# EAGLE design binaryspaceflower (EAGLE 6.5.0)
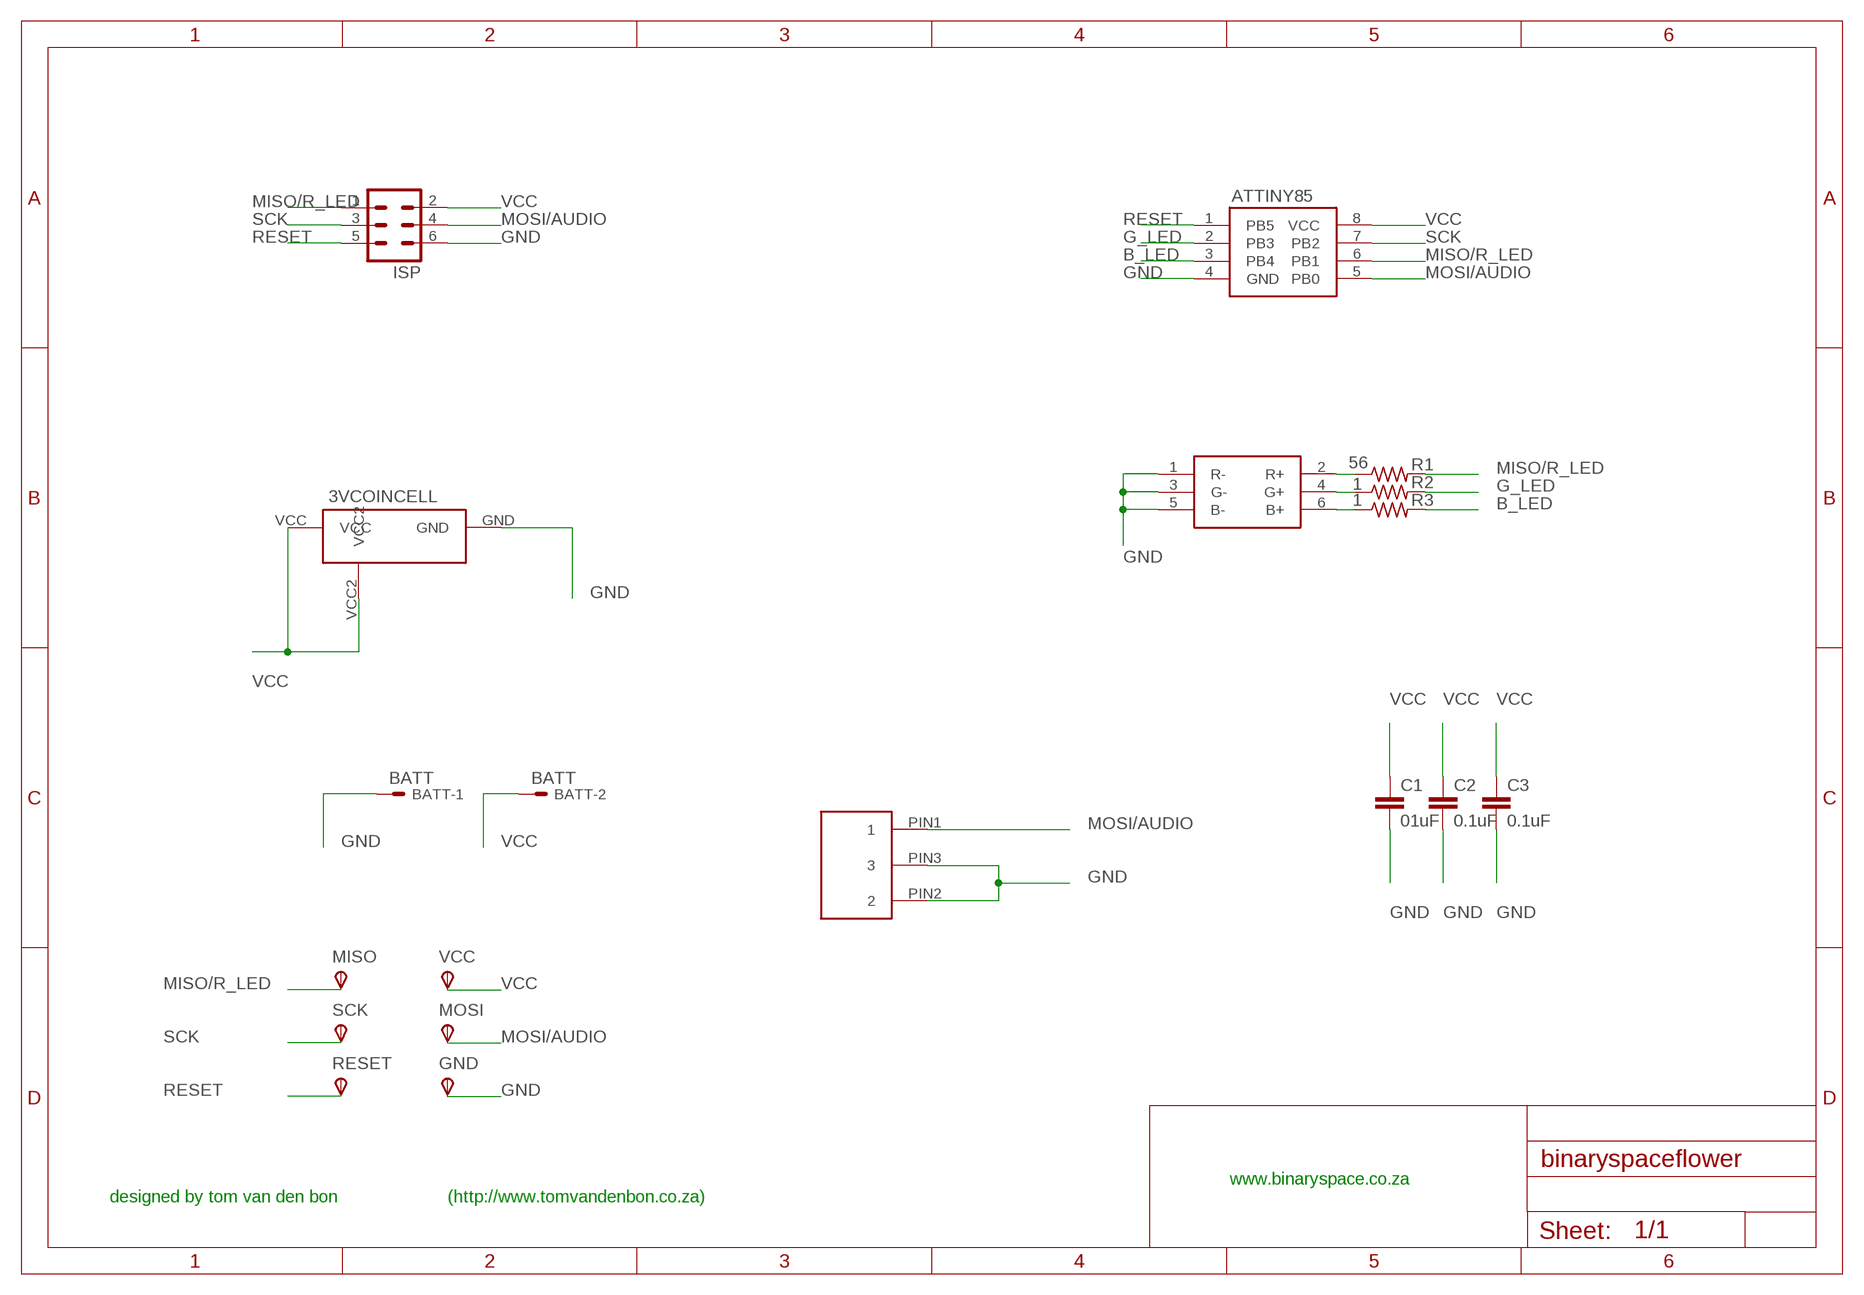
[diagram p0: schematic, sheet 1]

## Parts
3VCOINCELL  SMD_COINCELL_HOLDERRS  [SMD_COINCELLHOLDER]
ATTINY85  ATTINY85ATTINY85  [SOIC-20]
BATT  BATT  332-02  [332-02]
C1  01uF  C-EUC0603  [C0603]
C2  0.1uF  C-EUC0603  [C0603]
C3  0.1uF  C-EUC0603  [C0603]
GND  TPSTP09R  [TP09R]
ISP  MA03-2  [MA03-2]
MISO  TPSTP09R  [TP09R]
MOSI  TPSTP09R  [TP09R]
R1  56  R-US_R0603  [R0603]
R2  1  R-US_R0603  [R0603]
R3  1  R-US_R0603  [R0603]
RESET  TPSTP09R  [TP09R]
SCK  TPSTP09R  [TP09R]
U$2  RGB_SMD_LEDRS  [SMD_RGB_769-2996]
U$3  2.5MMAUDIOJACKMANTECH  [K3624]
VCC  TPSTP09R  [TP09R]

## Nets
B_LED: ATTINY85.3(PB4) R3.2
G_LED: ATTINY85.2(PB3) R2.2
GND: 3VCOINCELL.GND ATTINY85.4(GND) BATT.1 C1.2 C2.2 C3.2 GND.TP(PP) ISP.6 U$2.1(R-) U$2.3(G-) U$2.5(B-) U$3.PIN2 U$3.PIN3
MISO/R_LED: ATTINY85.6(PB1) ISP.1 MISO.TP(PP) R1.2
MOSI/AUDIO: ATTINY85.5(PB0) ISP.4 MOSI.TP(PP) U$3.PIN1
N$1: R1.1 U$2.2(R+)
N$2: R2.1 U$2.4(G+)
N$3: R3.1 U$2.6(B+)
RESET: ATTINY85.1(PB5) ISP.5 RESET.TP(PP)
SCK: ATTINY85.7(PB2) ISP.3 SCK.TP(PP)
VCC: 3VCOINCELL.VCC 3VCOINCELL.VCC2 ATTINY85.8(VCC) BATT.2 C1.1 C2.1 C3.1 ISP.2 VCC.TP(PP)

## Notes on the sheet
- www.binaryspace.co.za
- designed by tom van den bon | (http://www.tomvandenbon.co.za)

## Library data of the parts
3VCOINCELL = protofactory:SMD_COINCELL_HOLDER
ATTINY85 = protofactory:ATTINY85
BATT = con-garry:332-02: 2 Pin - 2mm Dual Row Source: www.mpe-connector.de / garry_shortform_2012.pdf
C1-C3 = rcl:C-EU: CAPACITOR, European symbol
GND MISO MOSI RESET SCK VCC = testpad:TPS: TEST PIN
ISP = con-lstb:MA03-2: PIN HEADER; OC_FARNELL: unknown; OC_NEWARK: unknown
R1-R3 = resistor:R-US_: RESISTOR, American symbol
U$2 = protofactory:RGB_SMD_LED
U$3 = protofactory:2.5MMAUDIOJACK

## Board
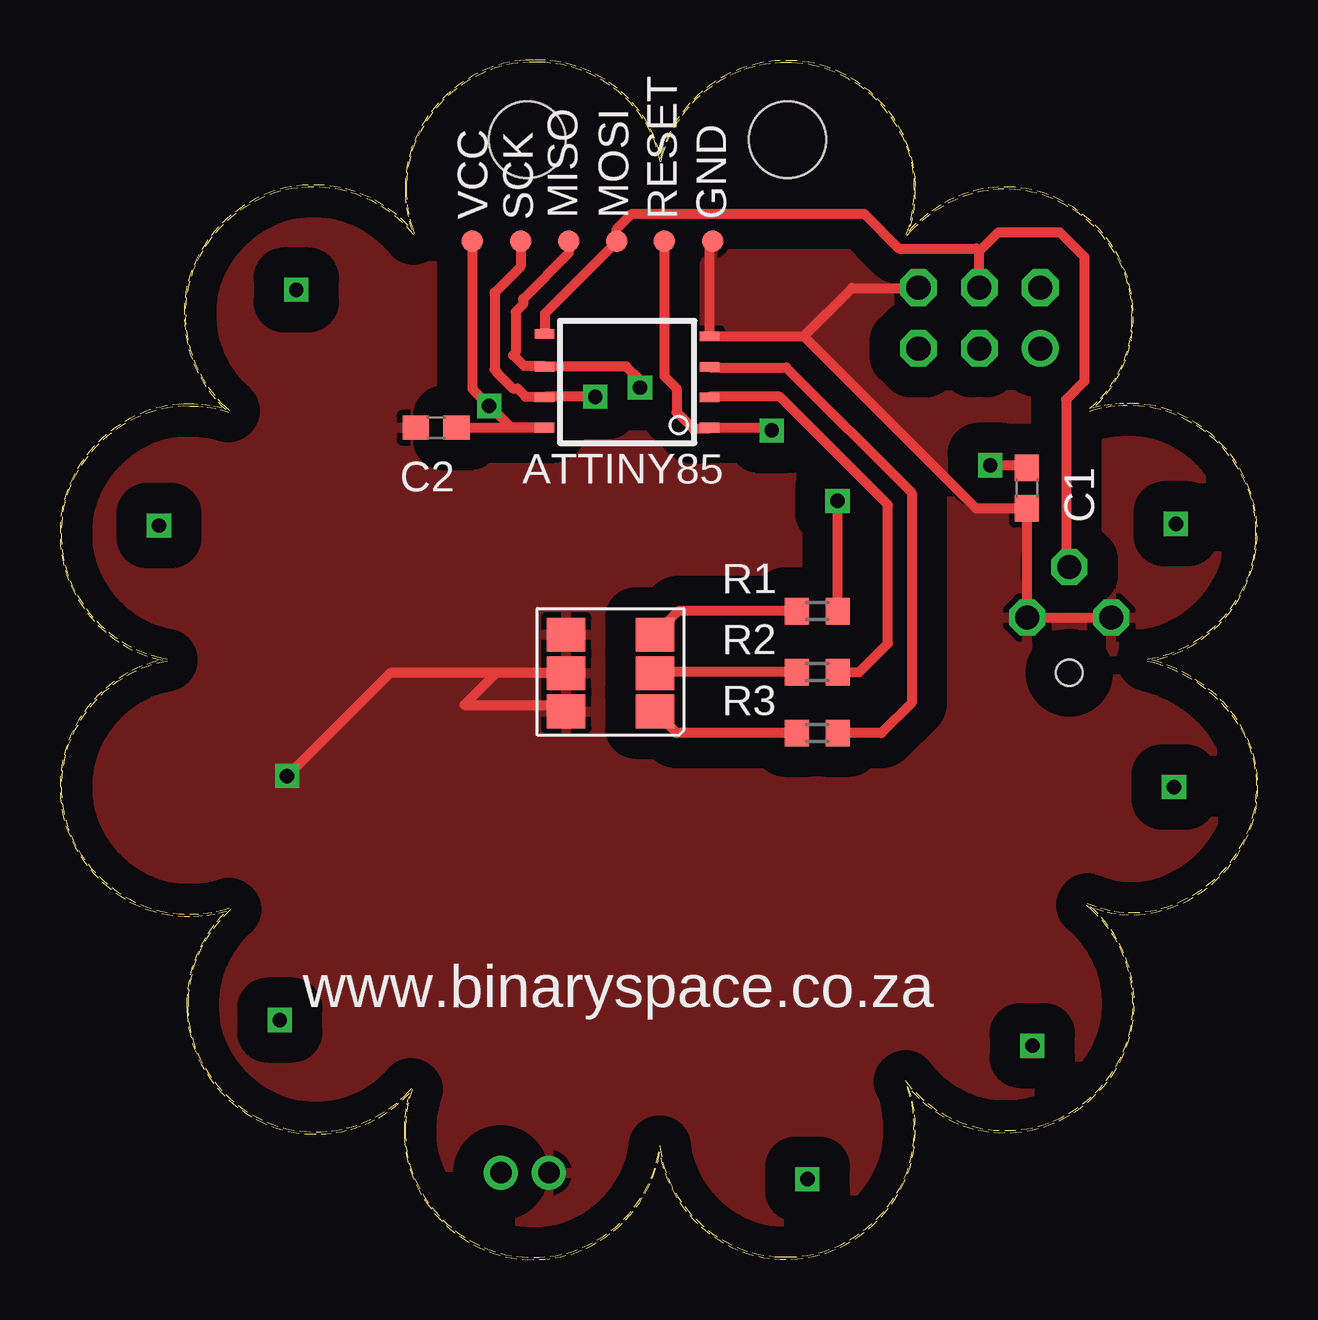
[diagram p1: board, top side]
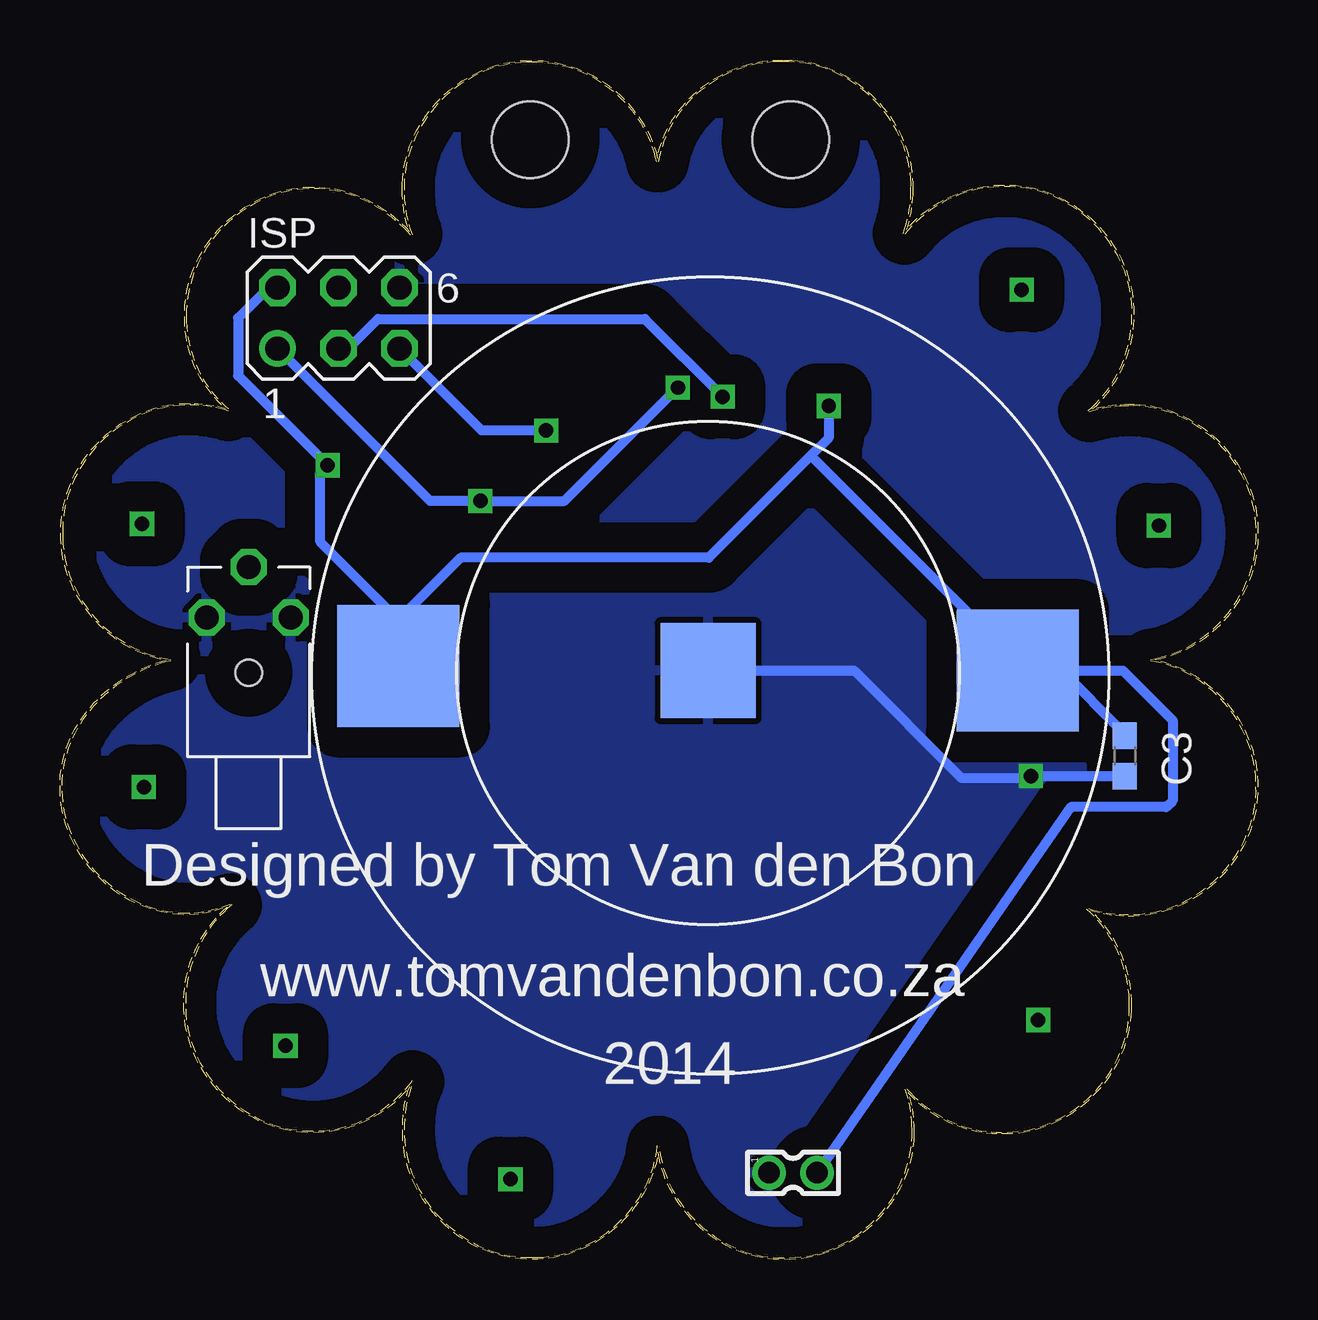
[diagram p2: board, bottom side, seen from below]

Size 49.91 x 50 mm. Coordinates in mm from the lower left corner, seen from the top.
Outline: 18.95,49.94 19.18,49.98 19.41,49.99 19.64,49.99 19.69,50 19.73,50
Outline: 18.72,49.91 18.49,49.86 18.27,49.79
Outline: 18.05,49.73 17.83,49.64 17.62,49.55
Outline: 17.41,49.45 17.2,49.35 17.01,49.22
Outline: 16.81,49.1 16.62,48.97 16.44,48.83
Outline: 16.26,48.68 16.08,48.53 15.92,48.36
Outline: 15.76,48.19 15.61,48.02 15.47,47.83
Outline: 15.33,47.65 15.2,47.46 15.08,47.25
Outline: 14.97,47.05 14.86,46.85 14.77,46.63
Outline: 14.68,46.42 14.61,46.2 14.55,45.97
Outline: 14.49,45.75 14.45,45.52 14.42,45.29
Outline: 14.39,45.07 14.38,44.83 14.38,44.6 14.38,44.41 14.4,44.22 14.42,44.03
Outline: 14.46,44.6 14.45,44.84 14.46,45.07 14.49,45.3
Outline: 14.52,45.53 14.57,45.76 14.63,45.98
Outline: 14.69,46.21 14.76,46.43 14.85,46.64
Outline: 14.95,46.85 15.05,47.06 15.17,47.26
Outline: 15.29,47.46 15.42,47.65 15.56,47.83
Outline: 15.7,48.02 15.86,48.19 16.02,48.36
Outline: 16.18,48.52 16.36,48.68 16.54,48.82
Outline: 16.73,48.96 16.92,49.09 17.12,49.21
Outline: 17.32,49.33 17.53,49.43 17.74,49.52
Outline: 17.95,49.62 18.17,49.69 18.4,49.75
Outline: 18.62,49.81 18.85,49.86 19.08,49.89
Outline: 19.31,49.92 19.54,49.93 19.78,49.92
Outline: 19.78,49.92 20,49.93 20.22,49.92 20.44,49.89
Outline: 20.66,49.87 20.87,49.83 21.08,49.78
Outline: 21.3,49.73 21.51,49.66 21.71,49.59
Outline: 21.92,49.51 22.12,49.42 22.31,49.32
Outline: 22.51,49.22 22.7,49.1 22.88,48.98
Outline: 23.06,48.85 23.23,48.71 23.39,48.57
Outline: 23.56,48.42 23.71,48.27 23.86,48.1
Outline: 24,47.94 24.14,47.76 24.26,47.58
Outline: 24.38,47.39 24.49,47.2 24.58,47.01
Outline: 24.68,46.81 24.76,46.61 24.83,46.4
Outline: 24.89,46.19 24.94,45.97 24.98,45.75
Outline: 25.06,45.75 25.1,45.97 25.16,46.18 25.23,46.38
Outline: 25.31,46.59 25.39,46.79 25.49,46.98
Outline: 25.59,47.17 25.7,47.36 25.82,47.54
Outline: 25.95,47.72 26.08,47.89 26.22,48.06
Outline: 26.37,48.22 26.52,48.38 26.68,48.52
Outline: 26.84,48.67 27.01,48.8 27.19,48.93
Outline: 27.37,49.05 27.55,49.17 27.74,49.27
Outline: 27.94,49.38 28.13,49.47 28.34,49.55
Outline: 28.54,49.63 28.74,49.7 28.96,49.75
Outline: 29.17,49.8 29.38,49.84 29.6,49.87
Outline: 29.81,49.89 30.03,49.9 30.25,49.9
Outline: 30.25,49.9 30.49,49.91 30.72,49.89 30.95,49.86
Outline: 31.18,49.84 31.41,49.79 31.63,49.73
Outline: 31.86,49.67 32.08,49.59 32.29,49.5
Outline: 32.5,49.41 32.71,49.3 32.91,49.19
Outline: 33.11,49.07 33.3,48.94 33.48,48.8
Outline: 33.67,48.65 33.84,48.5 34.01,48.34
Outline: 34.17,48.17 34.33,48 34.47,47.81
Outline: 34.61,47.63 34.74,47.44 34.86,47.24
Outline: 34.98,47.04 35.08,46.83 35.17,46.62
Outline: 35.27,46.4 35.34,46.18 35.4,45.96
Outline: 35.46,45.74 35.51,45.51 35.54,45.28
Outline: 35.57,45.05 35.58,44.81 35.57,44.58
Outline: 35.57,44.37 35.56,44.16 35.54,43.95
Outline: 35.51,43.74 35.48,43.53 35.43,43.33
Outline: 35.38,43.13 35.32,42.92 35.24,42.73
Outline: 35.3,42.69 35.44,42.86 35.6,43.01 35.76,43.16
Outline: 35.92,43.31 36.09,43.45 36.27,43.58
Outline: 36.44,43.71 36.63,43.83 36.82,43.94
Outline: 37.01,44.05 37.2,44.14 37.4,44.23
Outline: 37.61,44.31 37.81,44.39 38.02,44.45
Outline: 38.24,44.51 38.45,44.55 38.67,44.58
Outline: 38.88,44.61 39.1,44.63 39.32,44.63
Outline: 39.56,44.63 39.79,44.62 40.02,44.59
Outline: 40.25,44.56 40.48,44.52 40.7,44.46
Outline: 40.92,44.4 41.14,44.32 41.36,44.23
Outline: 41.57,44.14 41.78,44.03 41.98,43.91
Outline: 42.18,43.8 42.37,43.67 42.55,43.53
Outline: 42.74,43.38 42.91,43.23 43.08,43.06
Outline: 43.24,42.9 43.4,42.72 43.54,42.54
Outline: 43.68,42.36 43.81,42.16 43.93,41.96
Outline: 44.05,41.76 44.15,41.56 44.24,41.34
Outline: 44.33,41.13 44.41,40.91 44.47,40.69
Outline: 44.53,40.46 44.58,40.24 44.61,40
Outline: 44.63,39.77 44.65,39.54 44.64,39.31
Outline: 44.64,39.31 44.65,39.1 44.64,38.89 44.61,38.68
Outline: 44.59,38.48 44.55,38.27 44.5,38.07
Outline: 44.45,37.87 44.39,37.67 44.32,37.48
Outline: 44.24,37.28 44.16,37.09 44.06,36.91
Outline: 43.96,36.72 43.85,36.55 43.73,36.38
Outline: 43.61,36.21 43.48,36.04 43.34,35.89
Outline: 43.2,35.74 43.05,35.6 42.89,35.46
Outline: 42.9,35.37 43.07,35.43 43.24,35.47 43.42,35.51
Outline: 43.59,35.54 43.77,35.57 43.95,35.58
Outline: 44.12,35.6 44.3,35.61 44.48,35.61
Outline: 44.71,35.61 44.95,35.6 45.18,35.57
Outline: 45.41,35.54 45.63,35.5 45.86,35.44
Outline: 46.08,35.38 46.3,35.3 46.52,35.21
Outline: 46.73,35.12 46.94,35.01 47.14,34.89
Outline: 47.34,34.78 47.53,34.65 47.71,34.51
Outline: 47.89,34.36 48.07,34.21 48.24,34.04
Outline: 48.4,33.88 48.55,33.7 48.7,33.52
Outline: 48.84,33.34 48.97,33.15 49.09,32.94
Outline: 49.2,32.74 49.31,32.54 49.4,32.32
Outline: 49.49,32.11 49.57,31.89 49.63,31.67
Outline: 49.69,31.44 49.74,31.22 49.76,30.98
Outline: 49.79,30.76 49.81,30.52 49.8,30.29
Outline: 49.8,30.29 49.8,30.06 49.79,29.83 49.76,29.6
Outline: 49.74,29.38 49.69,29.15 49.63,28.93
Outline: 49.57,28.71 49.5,28.49 49.41,28.28
Outline: 49.33,28.07 49.22,27.86 49.11,27.67
Outline: 49,27.47 48.87,27.28 48.73,27.1
Outline: 48.6,26.91 48.45,26.74 48.29,26.57
Outline: 48.13,26.41 47.96,26.26 47.78,26.11
Outline: 47.61,25.97 47.42,25.84 47.22,25.72
Outline: 47.03,25.6 46.83,25.49 46.62,25.4
Outline: 46.41,25.31 46.19,25.23 45.97,25.16
Outline: 45.76,25.1 45.53,25.05 45.3,25.02
Outline: 45.3,24.95 45.52,24.9 45.74,24.84 45.95,24.77
Outline: 46.16,24.69 46.37,24.61 46.57,24.51
Outline: 46.78,24.42 46.97,24.31 47.17,24.19
Outline: 47.36,24.07 47.54,23.94 47.72,23.8
Outline: 47.9,23.67 48.07,23.52 48.23,23.36
Outline: 48.39,23.21 48.54,23.04 48.68,22.87
Outline: 48.83,22.69 48.96,22.51 49.08,22.32
Outline: 49.2,22.13 49.3,21.93 49.4,21.73
Outline: 49.49,21.53 49.57,21.31 49.64,21.1
Outline: 49.7,20.88 49.75,20.67 49.79,20.44
Outline: 49.82,20.22 49.84,20 49.84,19.77
Outline: 49.84,19.54 49.83,19.3 49.8,19.07
Outline: 49.77,18.84 49.73,18.61 49.67,18.39
Outline: 49.6,18.17 49.53,17.95 49.44,17.73
Outline: 49.35,17.52 49.24,17.31 49.12,17.11
Outline: 49,16.91 48.87,16.72 48.73,16.54
Outline: 48.59,16.35 48.44,16.18 48.27,16.01
Outline: 48.11,15.85 47.93,15.7 47.75,15.55
Outline: 47.57,15.41 47.37,15.28 47.17,15.16
Outline: 46.97,15.04 46.77,14.94 46.55,14.85
Outline: 46.34,14.76 46.12,14.68 45.89,14.62
Outline: 45.67,14.56 45.44,14.51 45.21,14.48
Outline: 44.98,14.45 44.75,14.44 44.51,14.45
Outline: 44.32,14.45 44.12,14.47 43.93,14.5
Outline: 43.74,14.54 43.55,14.58 43.36,14.64
Outline: 43.17,14.7 42.99,14.76 42.81,14.83
Outline: 42.76,14.77 42.94,14.63 43.1,14.48 43.25,14.31
Outline: 43.4,14.15 43.54,13.98 43.67,13.8
Outline: 43.8,13.62 43.92,13.43 44.02,13.24
Outline: 44.13,13.04 44.22,12.84 44.31,12.64
Outline: 44.39,12.43 44.46,12.22 44.51,12
Outline: 44.57,11.79 44.61,11.57 44.64,11.35
Outline: 44.67,11.13 44.68,10.91 44.68,10.69
Outline: 44.68,10.45 44.67,10.22 44.64,9.99
Outline: 44.61,9.76 44.57,9.53 44.51,9.31
Outline: 44.45,9.08 44.37,8.86 44.28,8.65
Outline: 44.19,8.43 44.08,8.23 43.96,8.03
Outline: 43.85,7.83 43.72,7.64 43.57,7.45
Outline: 43.43,7.27 43.28,7.09 43.11,6.93
Outline: 42.95,6.76 42.77,6.61 42.59,6.47
Outline: 42.41,6.33 42.21,6.2 42.01,6.08
Outline: 41.81,5.96 41.61,5.85 41.39,5.76
Outline: 41.18,5.67 40.96,5.6 40.74,5.53
Outline: 40.51,5.47 40.28,5.43 40.05,5.4
Outline: 39.82,5.37 39.59,5.36 39.36,5.36
Outline: 39.13,5.36 38.9,5.37 38.67,5.4
Outline: 38.45,5.44 38.22,5.48 38,5.55
Outline: 37.78,5.61 37.57,5.68 37.36,5.78
Outline: 37.15,5.87 36.95,5.97 36.75,6.09
Outline: 36.56,6.21 36.37,6.34 36.19,6.48
Outline: 36.01,6.62 35.84,6.77 35.68,6.94
Outline: 35.52,7.1 35.37,7.27 35.23,7.46
Outline: 35.23,7.46 35.23,7.46 35.23,7.46
Outline: 35.17,7.43 35.17,7.42 35.17,7.42 35.17,7.42
Outline: 35.27,7.21 35.35,7 35.41,6.77
Outline: 35.47,6.55 35.51,6.33 35.53,6.1
Outline: 35.55,5.87 35.56,5.64 35.56,5.41
Outline: 35.56,5.18 35.55,4.95 35.52,4.72
Outline: 35.5,4.49 35.45,4.26 35.39,4.03
Outline: 35.33,3.81 35.25,3.59 35.16,3.38
Outline: 35.07,3.16 34.96,2.96 34.85,2.76
Outline: 34.73,2.56 34.6,2.36 34.46,2.18
Outline: 34.31,2 34.16,1.82 34,1.66
Outline: 33.83,1.49 33.65,1.34 33.47,1.2
Outline: 33.29,1.05 33.1,0.92 32.9,0.81
Outline: 32.7,0.69 32.49,0.58 32.28,0.49
Outline: 32.06,0.4 31.84,0.32 31.62,0.26
Outline: 31.39,0.2 31.17,0.16 30.93,0.13
Outline: 30.71,0.1 30.47,0.09 30.24,0.09
Outline: 30.24,0.09 30,0.09 29.77,0.1 29.54,0.13
Outline: 29.31,0.16 29.09,0.2 28.86,0.26
Outline: 28.64,0.33 28.42,0.4 28.21,0.5
Outline: 28,0.59 27.79,0.69 27.59,0.81
Outline: 27.4,0.93 27.21,1.06 27.02,1.2
Outline: 26.84,1.35 26.67,1.5 26.51,1.67
Outline: 26.34,1.83 26.19,2.01 26.05,2.19
Outline: 25.91,2.38 25.78,2.57 25.67,2.77
Outline: 25.55,2.97 25.45,3.18 25.36,3.39
Outline: 25.28,3.61 25.2,3.83 25.15,4.05
Outline: 25.09,4.27 25.05,4.5 25.02,4.73
Outline: 24.95,4.72 24.95,4.72 24.95,4.72 24.95,4.72
Outline: 24.92,4.48 24.88,4.26 24.83,4.03
Outline: 24.77,3.81 24.69,3.59 24.61,3.38
Outline: 24.52,3.16 24.42,2.95 24.3,2.75
Outline: 24.19,2.55 24.06,2.36 23.92,2.18
Outline: 23.78,1.99 23.63,1.82 23.46,1.65
Outline: 23.3,1.49 23.13,1.33 22.95,1.19
Outline: 22.77,1.05 22.57,0.91 22.38,0.8
Outline: 22.18,0.68 21.97,0.57 21.76,0.48
Outline: 21.55,0.39 21.33,0.31 21.11,0.25
Outline: 20.88,0.19 20.66,0.14 20.43,0.11
Outline: 20.2,0.08 19.97,0.07 19.73,0.08
Outline: 19.5,0.07 19.27,0.08 19.04,0.11
Outline: 18.81,0.14 18.58,0.19 18.36,0.25
Outline: 18.13,0.31 17.91,0.38 17.7,0.48
Outline: 17.48,0.57 17.28,0.67 17.08,0.79
Outline: 16.88,0.91 16.68,1.04 16.5,1.18
Outline: 16.32,1.32 16.14,1.48 15.98,1.64
Outline: 15.81,1.81 15.66,1.98 15.52,2.16
Outline: 15.37,2.35 15.24,2.54 15.13,2.74
Outline: 15.01,2.94 14.9,3.15 14.81,3.36
Outline: 14.72,3.57 14.64,3.79 14.58,4.02
Outline: 14.52,4.24 14.48,4.47 14.45,4.7
Outline: 14.42,4.93 14.41,5.16 14.41,5.4
Outline: 14.38,4.69 14.35,4.93 14.33,5.16 14.34,5.4 14.34,5.58 14.35,5.75
Outline: 14.4,4.46 14.45,4.23 14.51,4
Outline: 14.57,3.78 14.65,3.55 14.74,3.34
Outline: 14.83,3.12 14.94,2.91 15.06,2.7
Outline: 15.18,2.5 15.31,2.31 15.46,2.12
Outline: 15.6,1.93 15.76,1.76 15.92,1.59
Outline: 16.09,1.42 16.27,1.27 16.45,1.12
Outline: 16.64,0.98 16.84,0.85 17.04,0.73
Outline: 17.24,0.61 17.45,0.5 17.67,0.41
Outline: 17.89,0.32 18.11,0.24 18.34,0.18
Outline: 18.56,0.12 18.79,0.07 19.03,0.04
Outline: 19.26,0.01 19.5,0 19.73,0
Outline: 19.96,0 20.19,0.01 20.41,0.04
Outline: 20.64,0.07 20.86,0.11 21.08,0.17
Outline: 21.3,0.23 21.52,0.3 21.73,0.39
Outline: 21.94,0.47 22.14,0.57 22.34,0.69
Outline: 22.53,0.8 22.72,0.93 22.9,1.06
Outline: 23.08,1.2 23.26,1.35 23.42,1.51
Outline: 23.58,1.67 23.74,1.83 23.88,2.01
Outline: 24.02,2.19 24.15,2.37 24.27,2.57
Outline: 24.39,2.76 24.5,2.96 24.59,3.17
Outline: 24.68,3.37 24.77,3.58 24.83,3.8
Outline: 24.9,4.02 24.95,4.24 24.99,4.46
Outline: 25.02,4.24 25.08,4.02 25.14,3.8
Outline: 25.21,3.59 25.29,3.38 25.39,3.17
Outline: 25.48,2.96 25.59,2.76 25.71,2.57
Outline: 25.82,2.38 25.96,2.19 26.1,2.02
Outline: 26.24,1.84 26.4,1.67 26.56,1.52
Outline: 26.72,1.36 26.89,1.21 27.07,1.08
Outline: 27.25,0.94 27.44,0.81 27.64,0.7
Outline: 27.84,0.59 28.04,0.49 28.25,0.4
Outline: 28.46,0.31 28.67,0.24 28.89,0.18
Outline: 29.11,0.13 29.33,0.08 29.56,0.05
Outline: 29.78,0.03 30.01,0.02 30.24,0.02
Outline: 30.24,0.02 30.24,0.02
Outline: 30.24,0.02 30.24,0.02
Outline: 30.48,0.02 30.71,0.03 30.94,0.06
Outline: 31.18,0.09 31.41,0.13 31.64,0.19
Outline: 31.86,0.25 32.09,0.33 32.3,0.43
Outline: 32.52,0.52 32.73,0.62 32.93,0.74
Outline: 33.13,0.86 33.33,1 33.52,1.14
Outline: 33.7,1.28 33.88,1.44 34.05,1.61
Outline: 34.21,1.77 34.37,1.95 34.51,2.14
Outline: 34.66,2.32 34.79,2.52 34.91,2.72
Outline: 35.03,2.92 35.13,3.13 35.23,3.35
Outline: 35.32,3.57 35.4,3.79 35.46,4.02
Outline: 35.52,4.24 35.57,4.47 35.6,4.71
Outline: 35.62,4.94 35.64,5.18 35.63,5.41
Outline: 35.63,5.41 35.63,5.42
Outline: 35.63,5.42 35.63,5.42
Outline: 35.63,5.62 35.63,5.82 35.61,6.02
Outline: 35.59,6.22 35.56,6.42 35.52,6.62
Outline: 35.47,6.82 35.42,7.02 35.34,7.2
Outline: 35.48,7.04 35.63,6.88 35.79,6.73
Outline: 35.95,6.58 36.12,6.44 36.3,6.31
Outline: 36.47,6.18 36.65,6.06 36.84,5.95
Outline: 37.04,5.84 37.23,5.75 37.44,5.66
Outline: 37.64,5.58 37.84,5.51 38.06,5.46
Outline: 38.27,5.4 38.48,5.36 38.7,5.33
Outline: 38.92,5.3 39.13,5.29 39.35,5.29
Outline: 39.36,5.29 39.36,5.29
Outline: 39.36,5.29 39.36,5.29
Outline: 39.59,5.29 39.83,5.3 40.06,5.33
Outline: 40.3,5.36 40.53,5.4 40.75,5.47
Outline: 40.98,5.53 41.2,5.61 41.42,5.7
Outline: 41.64,5.79 41.85,5.9 42.05,6.02
Outline: 42.25,6.14 42.45,6.27 42.63,6.41
Outline: 42.82,6.56 43,6.71 43.16,6.88
Outline: 43.33,7.04 43.49,7.22 43.63,7.41
Outline: 43.77,7.59 43.91,7.79 44.03,7.99
Outline: 44.15,8.2 44.25,8.4 44.34,8.62
Outline: 44.44,8.84 44.52,9.06 44.58,9.29
Outline: 44.64,9.52 44.68,9.75 44.71,9.98
Outline: 44.74,10.21 44.75,10.45 44.75,10.69
Outline: 44.75,10.69 44.75,10.69
Outline: 44.75,10.69 44.75,10.69
Outline: 44.75,10.9 44.74,11.12 44.71,11.33
Outline: 44.69,11.55 44.65,11.76 44.6,11.97
Outline: 44.54,12.18 44.48,12.39 44.4,12.59
Outline: 44.33,12.79 44.24,12.99 44.14,13.18
Outline: 44.04,13.37 43.93,13.55 43.8,13.73
Outline: 43.68,13.91 43.55,14.08 43.41,14.25
Outline: 43.27,14.41 43.12,14.56 42.95,14.7
Outline: 43.12,14.64 43.29,14.59 43.46,14.54
Outline: 43.63,14.49 43.81,14.45 43.98,14.42
Outline: 44.16,14.39 44.33,14.37 44.51,14.38
Outline: 44.51,14.38 44.51,14.38
Outline: 44.51,14.38 44.51,14.38
Outline: 44.75,14.37 44.99,14.38 45.22,14.41
Outline: 45.45,14.44 45.69,14.49 45.91,14.55
Outline: 46.14,14.61 46.36,14.69 46.58,14.78
Outline: 46.8,14.87 47.01,14.98 47.21,15.1
Outline: 47.41,15.22 47.61,15.35 47.79,15.49
Outline: 47.98,15.64 48.16,15.8 48.32,15.96
Outline: 48.49,16.13 48.65,16.3 48.79,16.49
Outline: 48.93,16.68 49.07,16.87 49.19,17.07
Outline: 49.31,17.28 49.41,17.49 49.5,17.71
Outline: 49.6,17.92 49.67,18.15 49.74,18.37
Outline: 49.8,18.6 49.84,18.83 49.87,19.07
Outline: 49.9,19.3 49.91,19.53 49.91,19.77
Outline: 49.91,20 49.89,20.22 49.86,20.44
Outline: 49.83,20.66 49.78,20.87 49.72,21.09
Outline: 49.65,21.3 49.58,21.51 49.48,21.71
Outline: 49.39,21.91 49.29,22.11 49.17,22.3
Outline: 49.06,22.49 48.93,22.67 48.79,22.85
Outline: 48.65,23.02 48.5,23.19 48.35,23.35
Outline: 48.19,23.5 48.03,23.65 47.85,23.79
Outline: 47.68,23.93 47.5,24.06 47.31,24.18
Outline: 47.12,24.3 46.93,24.41 46.73,24.51
Outline: 46.53,24.61 46.33,24.7 46.12,24.78
Outline: 45.91,24.86 45.7,24.93 45.49,24.98
Outline: 45.71,25.02 45.93,25.07 46.14,25.14
Outline: 46.36,25.21 46.57,25.3 46.77,25.39
Outline: 46.98,25.49 47.18,25.6 47.37,25.73
Outline: 47.56,25.85 47.74,25.98 47.91,26.13
Outline: 48.09,26.27 48.25,26.43 48.41,26.59
Outline: 48.56,26.76 48.7,26.93 48.84,27.12
Outline: 48.97,27.3 49.09,27.49 49.2,27.69
Outline: 49.31,27.88 49.41,28.09 49.5,28.3
Outline: 49.58,28.51 49.65,28.72 49.71,28.94
Outline: 49.77,29.16 49.81,29.38 49.84,29.61
Outline: 49.86,29.83 49.88,30.06 49.87,30.29
Outline: 49.87,30.29 49.87,30.29
Outline: 49.87,30.29 49.87,30.29
Outline: 49.88,30.53 49.86,30.76 49.84,30.99
Outline: 49.81,31.23 49.76,31.46 49.7,31.68
Outline: 49.64,31.91 49.56,32.14 49.47,32.35
Outline: 49.37,32.57 49.27,32.78 49.15,32.98
Outline: 49.03,33.18 48.9,33.38 48.75,33.57
Outline: 48.61,33.75 48.45,33.93 48.29,34.1
Outline: 48.12,34.26 47.94,34.42 47.76,34.56
Outline: 47.57,34.71 47.37,34.84 47.17,34.96
Outline: 46.97,35.08 46.76,35.18 46.54,35.28
Outline: 46.33,35.37 46.1,35.45 45.88,35.51
Outline: 45.65,35.57 45.42,35.62 45.18,35.64
Outline: 44.95,35.67 44.72,35.69 44.48,35.68 44.48,35.68 44.48,35.68
Outline: 44.31,35.68 44.15,35.67 43.99,35.66
Outline: 43.83,35.64 43.67,35.62 43.5,35.6
Outline: 43.34,35.57 43.19,35.53 43.03,35.49
Outline: 43.18,35.62 43.33,35.77 43.46,35.92
Outline: 43.6,36.07 43.72,36.24 43.84,36.41
Outline: 43.95,36.58 44.06,36.75 44.15,36.93
Outline: 44.25,37.12 44.33,37.3 44.4,37.5
Outline: 44.47,37.69 44.53,37.89 44.58,38.09
Outline: 44.63,38.28 44.66,38.49 44.68,38.69
Outline: 44.71,38.9 44.72,39.1 44.71,39.31 44.71,39.31 44.71,39.31
Outline: 44.72,39.55 44.71,39.78 44.68,40.01
Outline: 44.65,40.25 44.6,40.48 44.54,40.7
Outline: 44.48,40.93 44.4,41.16 44.31,41.37
Outline: 44.22,41.59 44.11,41.8 43.99,42
Outline: 43.87,42.2 43.74,42.4 43.59,42.58
Outline: 43.45,42.77 43.3,42.95 43.13,43.12
Outline: 42.96,43.28 42.78,43.44 42.6,43.58
Outline: 42.41,43.73 42.22,43.86 42.01,43.98
Outline: 41.81,44.1 41.6,44.2 41.38,44.3
Outline: 41.17,44.39 40.95,44.47 40.72,44.53
Outline: 40.49,44.59 40.26,44.64 40.03,44.66
Outline: 39.79,44.69 39.56,44.71 39.32,44.7 39.32,44.7 39.32,44.7
Outline: 39.1,44.7 38.89,44.69 38.68,44.66
Outline: 38.47,44.63 38.26,44.58 38.05,44.53
Outline: 37.85,44.47 37.64,44.4 37.45,44.32
Outline: 37.25,44.24 37.06,44.15 36.87,44.05
Outline: 36.68,43.94 36.5,43.83 36.33,43.71
Outline: 36.15,43.58 35.98,43.45 35.82,43.31
Outline: 35.66,43.17 35.51,43.02 35.37,42.87
Outline: 35.43,43.05 35.48,43.24 35.52,43.42
Outline: 35.56,43.61 35.59,43.81 35.61,44
Outline: 35.63,44.19 35.65,44.38 35.64,44.58
Outline: 35.64,44.58 35.65,44.82 35.64,45.05 35.61,45.28
Outline: 35.58,45.52 35.53,45.75 35.47,45.98
Outline: 35.41,46.2 35.33,46.43 35.24,46.64
Outline: 35.15,46.86 35.04,47.07 34.92,47.27
Outline: 34.8,47.48 34.67,47.67 34.53,47.86
Outline: 34.38,48.04 34.23,48.22 34.06,48.39
Outline: 33.89,48.55 33.72,48.71 33.53,48.85
Outline: 33.34,49 33.15,49.13 32.95,49.25
Outline: 32.74,49.37 32.53,49.48 32.32,49.57
Outline: 32.1,49.66 31.88,49.74 31.65,49.8
Outline: 31.42,49.86 31.19,49.91 30.96,49.94
Outline: 30.73,49.97 30.49,49.98 30.25,49.97 30.25,49.97 30.25,49.97
Outline: 30.01,49.98 29.77,49.96 29.54,49.93
Outline: 29.3,49.9 29.07,49.85 28.84,49.79
Outline: 28.61,49.73 28.39,49.65 28.17,49.56
Outline: 27.95,49.47 27.74,49.36 27.53,49.24
Outline: 27.33,49.12 27.13,48.98 26.94,48.84
Outline: 26.76,48.69 26.58,48.53 26.41,48.36
Outline: 26.24,48.19 26.08,48.01 25.94,47.83
Outline: 25.8,47.64 25.66,47.44 25.55,47.23
Outline: 25.43,47.03 25.33,46.81 25.24,46.59
Outline: 25.15,46.37 25.08,46.14 25.02,45.91
Outline: 24.98,46.13 24.92,46.34 24.85,46.54
Outline: 24.78,46.75 24.69,46.95 24.59,47.14
Outline: 24.49,47.34 24.38,47.52 24.25,47.7
Outline: 24.13,47.88 24,48.05 23.85,48.22
Outline: 23.7,48.38 23.55,48.53 23.38,48.67
Outline: 23.22,48.82 23.05,48.95 22.86,49.07
Outline: 22.68,49.19 22.49,49.3 22.3,49.4
Outline: 22.11,49.5 21.91,49.59 21.7,49.67
Outline: 21.5,49.74 21.29,49.81 21.08,49.86
Outline: 20.87,49.91 20.65,49.94 20.43,49.97
Outline: 20.22,49.99 20,50 19.78,49.99
Outline: 19.78,49.99 19.78,49.99
Outline: 19.78,49.99 19.78,49.99
Outline: 14.41,5.4 14.41,5.59 14.42,5.78 14.44,5.97
Outline: 14.47,6.16 14.5,6.35 14.54,6.54
Outline: 14.58,6.72 14.63,6.91 14.69,7.09
Outline: 14.63,7.12 14.49,6.96 14.34,6.81 14.18,6.66
Outline: 14.02,6.52 13.86,6.39 13.68,6.26
Outline: 13.51,6.14 13.33,6.03 13.14,5.93
Outline: 12.95,5.82 12.76,5.74 12.56,5.66
Outline: 12.36,5.58 12.15,5.51 11.95,5.46
Outline: 11.74,5.41 11.53,5.37 11.32,5.34
Outline: 11.11,5.32 10.89,5.3 10.68,5.31
Outline: 10.44,5.3 10.21,5.31 9.98,5.34
Outline: 9.75,5.37 9.52,5.42 9.3,5.48
Outline: 9.08,5.54 8.86,5.61 8.64,5.7
Outline: 8.43,5.8 8.22,5.9 8.02,6.02
Outline: 7.82,6.14 7.63,6.27 7.45,6.41
Outline: 7.26,6.55 7.09,6.71 6.92,6.87
Outline: 6.76,7.04 6.6,7.21 6.46,7.39
Outline: 6.32,7.58 6.19,7.77 6.07,7.97
Outline: 5.95,8.17 5.85,8.38 5.76,8.59
Outline: 5.67,8.8 5.59,9.02 5.53,9.25
Outline: 5.47,9.47 5.42,9.7 5.39,9.93
Outline: 5.37,10.16 5.35,10.39 5.36,10.63
Outline: 5.32,9.92 5.29,10.16 5.28,10.39 5.29,10.63 5.28,10.84 5.3,11.05
Outline: 5.35,9.69 5.4,9.46 5.46,9.23
Outline: 5.52,9 5.6,8.78 5.69,8.57
Outline: 5.78,8.35 5.89,8.14 6.01,7.93
Outline: 6.13,7.73 6.26,7.54 6.41,7.35
Outline: 6.55,7.16 6.7,6.99 6.87,6.82
Outline: 7.04,6.66 7.22,6.5 7.4,6.35
Outline: 7.59,6.21 7.78,6.08 7.98,5.96
Outline: 8.19,5.84 8.4,5.73 8.62,5.64
Outline: 8.83,5.55 9.05,5.47 9.28,5.41
Outline: 9.51,5.35 9.74,5.3 9.97,5.27
Outline: 10.21,5.24 10.44,5.23 10.68,5.23 10.68,5.23 10.68,5.23
Outline: 10.89,5.23 11.1,5.24 11.31,5.27
Outline: 11.51,5.29 11.72,5.33 11.92,5.38
Outline: 12.12,5.43 12.32,5.49 12.52,5.57
Outline: 12.71,5.64 12.9,5.72 13.09,5.82
Outline: 13.27,5.91 13.45,6.02 13.63,6.14
Outline: 13.8,6.25 13.96,6.38 14.12,6.52
Outline: 14.28,6.65 14.43,6.8 14.57,6.95
Outline: 14.52,6.78 14.48,6.61 14.44,6.44
Outline: 14.41,6.27 14.39,6.1 14.37,5.92
Outline: 5.36,10.63 5.36,10.84 5.37,11.05 5.39,11.27
Outline: 5.42,11.48 5.46,11.69 5.51,11.89
Outline: 5.56,12.1 5.62,12.3 5.7,12.5
Outline: 5.77,12.7 5.86,12.9 5.96,13.09
Outline: 6.06,13.27 6.17,13.46 6.28,13.63
Outline: 6.4,13.81 6.53,13.98 6.67,14.14
Outline: 6.81,14.3 6.96,14.45 7.12,14.59
Outline: 7.05,14.64 6.87,14.58 6.69,14.53 6.51,14.5
Outline: 6.33,14.46 6.15,14.43 5.96,14.41
Outline: 5.78,14.39 5.59,14.38 5.41,14.38
Outline: 5.17,14.38 4.94,14.39 4.71,14.42
Outline: 4.48,14.45 4.25,14.49 4.03,14.55
Outline: 3.8,14.62 3.58,14.69 3.37,14.78
Outline: 3.16,14.87 2.95,14.98 2.75,15.1
Outline: 2.55,15.22 2.36,15.35 2.17,15.49
Outline: 1.99,15.63 1.81,15.78 1.65,15.95
Outline: 1.49,16.11 1.33,16.29 1.19,16.47
Outline: 1.05,16.65 0.92,16.85 0.8,17.05
Outline: 0.68,17.25 0.58,17.45 0.48,17.67
Outline: 0.39,17.88 0.31,18.1 0.25,18.33
Outline: 0.19,18.55 0.15,18.78 0.12,19.01
Outline: 0.09,19.24 0.08,19.47 0.08,19.71
Outline: 0.08,19.93 0.09,20.16 0.12,20.38
Outline: 0.15,20.6 0.19,20.82 0.25,21.04
Outline: 0.3,21.26 0.37,21.47 0.46,21.68
Outline: 0.54,21.89 0.64,22.09 0.75,22.29
Outline: 0.87,22.48 0.99,22.67 1.12,22.85
Outline: 1.25,23.03 1.4,23.21 1.55,23.37
Outline: 1.71,23.53 1.87,23.69 2.05,23.83
Outline: 2.22,23.97 2.4,24.11 2.59,24.23
Outline: 2.78,24.35 2.98,24.46 3.18,24.55
Outline: 3.39,24.65 3.6,24.73 3.81,24.79
Outline: 4.02,24.86 4.24,24.91 4.47,24.95
Outline: 4.47,25.02 4.24,25.06 4.02,25.11 3.81,25.17
Outline: 3.6,25.24 3.38,25.32 3.18,25.42
Outline: 2.98,25.51 2.78,25.62 2.59,25.74
Outline: 2.4,25.86 2.22,25.99 2.04,26.13
Outline: 1.87,26.28 1.7,26.43 1.55,26.59
Outline: 1.39,26.76 1.25,26.93 1.12,27.11
Outline: 0.98,27.29 0.86,27.48 0.75,27.68
Outline: 0.64,27.87 0.54,28.08 0.46,28.28
Outline: 0.37,28.49 0.3,28.7 0.24,28.92
Outline: 0.18,29.14 0.14,29.36 0.11,29.58
Outline: 0.09,29.81 0.07,30.03 0.08,30.26
Outline: 0.07,30.49 0.08,30.73 0.11,30.95
Outline: 0.14,31.19 0.19,31.41 0.25,31.64
Outline: 0.31,31.86 0.38,32.08 0.48,32.3
Outline: 0.57,32.51 0.67,32.72 0.79,32.92
Outline: 0.91,33.12 1.04,33.31 1.18,33.49
Outline: 1.32,33.67 1.48,33.85 1.64,34.02
Outline: 1.81,34.18 1.98,34.33 2.17,34.48
Outline: 2.35,34.62 2.54,34.75 2.74,34.87
Outline: 2.94,34.98 3.15,35.09 3.36,35.18
Outline: 3.57,35.27 3.79,35.35 4.02,35.41
Outline: 4.24,35.47 4.47,35.52 4.7,35.54
Outline: 4.93,35.57 5.16,35.58 5.4,35.58
Outline: 4.7,35.62 4.93,35.64 5.16,35.66 5.4,35.65 5.57,35.65 5.74,35.64
Outline: 4.46,35.59 4.23,35.54 4,35.48
Outline: 3.78,35.42 3.55,35.34 3.34,35.25
Outline: 3.12,35.16 2.91,35.05 2.7,34.93
Outline: 2.5,34.81 2.31,34.68 2.12,34.53
Outline: 1.93,34.39 1.76,34.23 1.59,34.07
Outline: 1.43,33.9 1.27,33.72 1.12,33.54
Outline: 0.98,33.35 0.85,33.16 0.73,32.95
Outline: 0.61,32.75 0.5,32.54 0.41,32.32
Outline: 0.32,32.11 0.24,31.88 0.18,31.66
Outline: 0.12,31.43 0.07,31.2 0.04,30.96
Outline: 0.01,30.73 0,30.5 0.01,30.26
Outline: 0.01,30.26 0.01,30.26
Outline: 0.01,30.26 0.01,30.26
Outline: 0,30.03 0.01,29.81 0.04,29.59
Outline: 0.07,29.37 0.11,29.15 0.16,28.94
Outline: 0.22,28.72 0.29,28.51 0.37,28.3
Outline: 0.45,28.1 0.55,27.89 0.65,27.7
Outline: 0.76,27.5 0.88,27.31 1.01,27.13
Outline: 1.14,26.95 1.28,26.78 1.43,26.62
Outline: 1.58,26.45 1.74,26.3 1.91,26.15
Outline: 2.08,26.01 2.25,25.87 2.44,25.75
Outline: 2.62,25.63 2.82,25.52 3.02,25.42
Outline: 3.21,25.32 3.42,25.23 3.63,25.16
Outline: 3.84,25.09 4.05,25.03 4.27,24.98
Outline: 4.06,24.94 3.84,24.88 3.63,24.81
Outline: 3.42,24.73 3.22,24.65 3.02,24.55
Outline: 2.82,24.45 2.63,24.34 2.44,24.21
Outline: 2.26,24.09 2.08,23.95 1.91,23.81
Outline: 1.74,23.66 1.58,23.51 1.43,23.35
Outline: 1.28,23.18 1.14,23.01 1.01,22.83
Outline: 0.89,22.65 0.77,22.46 0.66,22.26
Outline: 0.55,22.07 0.46,21.87 0.37,21.66
Outline: 0.29,21.46 0.22,21.24 0.17,21.03
Outline: 0.11,20.81 0.07,20.59 0.05,20.37
Outline: 0.02,20.15 0.01,19.93 0.01,19.71
Outline: 0.01,19.71 0.01,19.71
Outline: 0.01,19.71 0.01,19.71
Outline: 0.01,19.47 0.02,19.23 0.05,19
Outline: 0.08,18.77 0.12,18.53 0.18,18.31
Outline: 0.25,18.08 0.33,17.86 0.42,17.64
Outline: 0.51,17.42 0.62,17.21 0.73,17.01
Outline: 0.85,16.81 0.99,16.61 1.13,16.43
Outline: 1.28,16.24 1.43,16.06 1.6,15.9
Outline: 1.77,15.73 1.94,15.57 2.13,15.43
Outline: 2.31,15.29 2.51,15.15 2.71,15.03
Outline: 2.91,14.91 3.13,14.81 3.34,14.72
Outline: 3.56,14.62 3.78,14.55 4.01,14.48
Outline: 4.24,14.42 4.47,14.38 4.7,14.35
Outline: 4.93,14.32 5.17,14.31 5.41,14.31
Outline: 5.58,14.31 5.76,14.32 5.93,14.34
Outline: 6.1,14.35 6.28,14.38 6.45,14.41
Outline: 6.62,14.44 6.79,14.49 6.96,14.54
Outline: 6.81,14.39 6.66,14.24 6.53,14.08
Outline: 6.4,13.92 6.27,13.75 6.16,13.58
Outline: 6.05,13.4 5.95,13.22 5.85,13.04
Outline: 5.76,12.85 5.68,12.66 5.61,12.46
Outline: 5.54,12.27 5.48,12.07 5.43,11.87
Outline: 5.38,11.66 5.34,11.46 5.32,11.25
Outline: 5.4,35.58 5.58,35.58 5.77,35.57 5.95,35.55
Outline: 6.13,35.53 6.31,35.5 6.49,35.47
Outline: 6.67,35.43 6.85,35.38 7.02,35.33
Outline: 7.06,35.39 6.9,35.53 6.75,35.68 6.6,35.84
Outline: 6.46,36 6.32,36.17 6.2,36.35
Outline: 6.08,36.53 5.97,36.71 5.87,36.9
Outline: 5.77,37.09 5.68,37.29 5.6,37.49
Outline: 5.52,37.69 5.46,37.9 5.4,38.11
Outline: 5.35,38.32 5.31,38.53 5.29,38.75
Outline: 5.26,38.96 5.25,39.18 5.25,39.39
Outline: 5.25,39.63 5.26,39.86 5.29,40.09
Outline: 5.31,40.32 5.36,40.55 5.42,40.77
Outline: 5.48,41 5.56,41.22 5.65,41.43
Outline: 5.74,41.64 5.85,41.85 5.96,42.05
Outline: 6.08,42.25 6.21,42.44 6.35,42.63
Outline: 6.5,42.81 6.65,42.98 6.82,43.15
Outline: 6.98,43.31 7.16,43.47 7.34,43.61
Outline: 7.52,43.75 7.71,43.88 7.91,44
Outline: 8.11,44.12 8.32,44.22 8.53,44.32
Outline: 8.75,44.41 8.97,44.48 9.19,44.54
Outline: 9.42,44.6 9.64,44.65 9.88,44.68
Outline: 10.1,44.71 10.34,44.72 10.57,44.71
Outline: 10.8,44.72 11.03,44.7 11.25,44.68
Outline: 11.47,44.65 11.7,44.61 11.92,44.55
Outline: 12.14,44.49 12.35,44.42 12.56,44.33
Outline: 12.77,44.25 12.98,44.15 13.18,44.04
Outline: 13.37,43.93 13.56,43.81 13.74,43.67
Outline: 13.93,43.54 14.1,43.39 14.26,43.23
Outline: 14.43,43.08 14.58,42.91 14.72,42.73
Outline: 14.78,42.76 14.71,42.96 14.65,43.16 14.6,43.36
Outline: 14.56,43.56 14.52,43.77 14.49,43.98
Outline: 14.47,44.18 14.46,44.39 14.46,44.6
Outline: 14.44,43.84 14.47,43.66 14.51,43.47
Outline: 14.54,43.29 14.59,43.1 14.65,42.92
Outline: 14.51,43.09 14.35,43.25 14.19,43.4
Outline: 14.03,43.55 13.86,43.68 13.68,43.81
Outline: 13.5,43.94 13.31,44.05 13.11,44.16
Outline: 12.92,44.26 12.72,44.35 12.51,44.43
Outline: 12.31,44.51 12.1,44.58 11.88,44.63
Outline: 11.67,44.68 11.45,44.72 11.23,44.75
Outline: 11.02,44.78 10.79,44.79 10.57,44.79 10.57,44.79 10.57,44.79
Outline: 10.33,44.79 10.1,44.78 9.87,44.75
Outline: 9.63,44.72 9.4,44.67 9.17,44.61
Outline: 8.95,44.55 8.72,44.47 8.51,44.38
Outline: 8.29,44.29 8.08,44.18 7.88,44.06
Outline: 7.68,43.94 7.48,43.81 7.29,43.67
Outline: 7.11,43.52 6.93,43.37 6.76,43.2
Outline: 6.6,43.03 6.44,42.86 6.3,42.67
Outline: 6.15,42.48 6.02,42.29 5.9,42.09
Outline: 5.78,41.88 5.68,41.67 5.58,41.46
Outline: 5.49,41.24 5.41,41.02 5.35,40.79
Outline: 5.29,40.56 5.24,40.33 5.21,40.1
Outline: 5.19,39.87 5.17,39.63 5.18,39.39
Outline: 5.18,39.39 5.18,39.39
Outline: 5.18,39.39 5.18,39.39
Outline: 5.18,39.18 5.19,38.97 5.21,38.76
Outline: 5.24,38.55 5.27,38.34 5.32,38.13
Outline: 5.37,37.93 5.44,37.73 5.51,37.53
Outline: 5.58,37.33 5.67,37.14 5.76,36.95
Outline: 5.86,36.76 5.96,36.58 6.08,36.4
Outline: 6.2,36.23 6.32,36.06 6.46,35.9
Outline: 6.6,35.73 6.74,35.58 6.9,35.44
Outline: 6.74,35.49 6.57,35.52 6.41,35.56
Outline: 6.24,35.59 6.07,35.61 5.91,35.63
Copper layers (1*16): Top 0.035mm / dielectric 1.5mm / Bottom 0.035mm
Design rules "default": minimum track width 10mil, minimum drill 24mil, track to track 8mil, track to pad 8mil, pad to pad 8mil, via to via 8mil, smd to smd 8mil, copper to edge 40mil, drill to drill 8mil, minimum pad ring 10mil, minimum via ring 8mil, stop-mask expansion 4mil, vias tented up to drill 0mil, thermal gap 10mil
Holes 3.2 mm at 19.47,46.68 30.32,46.68

### Footprints (pad centres in the part's own frame; a part is rotated, then mirrored left to right if it is on the bottom)
SMD_COINCELLHOLDER = smd 3.96 x 3.96: GND 0,0.1 | smd 5.08 x 5.08: VCC -12.9,0.3; VCC2 12.9,0.1
SOIC-20 = smd 0.813 x 0.406: 1 0.415,4.01; 2 0.415,2.74; 3 0.415,1.47; 4 0.415,0.2; 5 7.295,0.1; 6 7.295,1.47; 7 7.295,2.74; 8 7.295,4.01
332-02 = drill 0.9 pad 1.27: 1 0,-1; 2 0,1
C0603 = smd 1.1 x 1: 1 -0.85,0; 2 0.85,0
TP09R = smd 0.9 x 0.9: TP 0,0
MA03-2 = drill 1.016: 1 -2.54,-1.27 | drill 1.016 octagon: 2 -2.54,1.27; 3 0,-1.27; 4 0,1.27; 5 2.54,-1.27; 6 2.54,1.27
R0603 = smd 1 x 1.1: 1 -0.85,0; 2 0.85,0
SMD_RGB_769-2996 = smd 1.6 x 1.4: 1 -1.9,1.6; 2 1.8,1.6; 3 -1.9,0; 4 1.8,0; 5 -1.9,-1.6; 6 1.8,-1.6
K3624 = drill 1 pad 1.1 octagon: PIN1 0.05,4.4; PIN2 -1.7,2.3; PIN3 1.8,2.3 | hole 1.1: 0.05,0

### Placement (x,y rotation side)
3VCOINCELL  22.91,24.45 0 bottom
ATTINY85  27.48,38.68 180 top
BATT  19.37,3.62 270 bottom
C1  40.28,32.15 270 top
C2  15.67,34.67 180 top
C3  5.54,20.99 270 bottom
GND  27.2,42.44 90 top
ISP  38.3,39.24 0 bottom
MISO  21.2,42.44 90 top
MOSI  23.2,42.44 90 top
R1  31.55,27.02 0 top
R2  31.55,24.48 0 top
R3  31.55,21.94 0 top
RESET  25.18,42.44 90 top
SCK  19.19,42.44 90 top
U$2  22.99,24.45 0 top
U$3  42,24.46 0 top
VCC  17.18,42.44 90 top

### Tracks (layer width: path | path; a pad name or v marks a point on that pad's centre or on a via)
B_LED
  Top 0.406: ATTINY85.3 27.1,37.18 30.26,37.18 35.48,31.96 35.48,23.2 34.23,21.94 R3.2
G_LED
  Top 0.406: R2.2 33.3,24.48 34.49,25.68 34.49,31.43 34.46,31.47 34.46,31.51 30,35.96 27.09,35.96 ATTINY85.2
GND  (via drill 0.6)
  Top 0.406: 43.75,26.71 U$3.PIN3 U$3.PIN2 40.3,31.29 C1.2 38.17,31.3 30.99,38.48 | 30.99,38.48 ATTINY85.4 27.07,42.31 GND.TP | 30.99,38.48 33.01,40.5 35.75,40.5 ISP.6 | 21.31,22.94 21.12,23.12 16.85,23.12 18.17,24.45 U$2.3 13.75,24.45 v9.46,20.15
  Bottom 0.406: C3.2 5.55,20.15 v9.46,20.15 9.54,20.08 12.36,20.08 16.83,24.55 3VCOINCELL.GND
  pour Top (isolate 1.27): -1.47,-0.99 50.76,-0.99 50.76,50.67 -1.4,50.67 -1.4,-0.92
  pour Bottom (isolate 1.27): -1.36,-1.03 51.11,-1.03 51.11,51.01 -1.47,51.01 -1.47,-1.11
MISO/R_LED  (via drill 0.6)
  Top 0.406: R1.2 v32.4,31.62 | v24.17,36.35 24.17,36.65 23.6,37.22 ATTINY85.6 20.14,37.26 19.33,37.26 18.91,37.68 18.87,37.68 18.99,37.79 18.99,39.51 19.29,39.81 19.29,40.04 21.2,41.95 MISO.TP
  Bottom 0.406: ISP.1 34.49,31.62 v32.4,31.62 28.89,31.62 v24.17,36.35
MOSI/AUDIO
  Top 0.406: ISP.4 38.3,42.02 | 38.3,42.02 39.1,42.82 41.66,42.82 42.69,41.79 42.69,36.61 41.92,35.85 41.92,28.98 U$3.PIN1 | ATTINY85.5 20.21,38.6 20.21,39.43 23.2,42.43 MOSI.TP 23.2,42.96 23.83,43.58 33.5,43.58 34.95,42.14 38.19,42.14 38.3,42.02
N$1
  Top 0.406: R1.1 25.77,27.02 U$2.2
N$2
  Top 0.406: R2.1 24.83,24.48 U$2.4
N$3
  Top 0.406: R3.1 25.69,21.94 U$2.6
N$4  (via drill 0.6)
  other vias: 4.13,30.59
N$5  (via drill 0.6)
  other vias: 9.84,40.42
N$7  (via drill 0.6)
  other vias: 9.16,9.98
N$9  (via drill 0.6)
  other vias: 31.14,3.35
N$10  (via drill 0.6)
  other vias: 40.51,8.91
N$11  (via drill 0.6)
  other vias: 46.42,19.7
N$12  (via drill 0.6)
  other vias: 46.5,30.67
RESET  (via drill 0.6)
  Top 0.406: v29.66,34.55 29.54,34.67 ATTINY85.1 27.03,34.63 26.38,34.63 25.69,35.32 25.69,36.31 25.18,36.82 RESET.TP
  Bottom 0.406: v29.66,34.55 32.35,34.55 ISP.5
SCK  (via drill 0.6)
  Top 0.406: v22.3,35.96 20.21,35.96 ATTINY85.7 20.17,35.96 19.41,35.96 19.06,36.31 18.87,36.31 18.19,36.99 18.19,37.03 18.11,37.11 18.11,40.31 19.19,41.39 SCK.TP
  Bottom 0.406: ISP.3 37.9,37.97 36.67,39.2 25.54,39.2 v22.3,35.96
VCC  (via drill 0.6)
  Top 0.406: 40.02,33.27 C1.1 40.18,33.11 v38.76,33.11 | C2.1 ATTINY85.8 18.79,34.67 v17.88,35.58 17.18,36.28 VCC.TP
  Bottom 0.406: C3.1 5.54,21.91 8.24,24.61 9.95,24.61 | 9.95,24.61 3VCOINCELL.VCC2 5.63,24.55 3.56,22.48 3.56,19.12 3.82,18.86 7.8,18.86 BATT.2 | 39.05,32.81 v38.76,33.11 | 3VCOINCELL.VCC 35.81,26.65 | 35.81,26.65 39.07,29.91 39.07,32.8 v38.76,33.11 | ISP.2 41.22,40.51 42.49,39.24 42.49,36.84 v38.76,33.11 | v17.88,35.58 17.88,34.25 18.63,33.51 | 18.63,33.51 22.87,29.26 33.2,29.26 35.81,26.65 | 9.95,24.61 9.95,24.83 18.63,33.51

### Text on the board
tNames: www.binaryspace.co.za
bNames: Designed by Tom Van den Bon | www.tomvandenbon.co.za | 2014